# Altium schematic sheet Microcode.SchDoc
size B; Author: E. Sims; Organization: Let's Build Rockets Inc.; SheetNumber: 3; SheetTotal: 6; ENG_APP_DATE: --/--/--; DSN_APP_DATE: --/--/--; CHK_APP_DATE: --/--/--
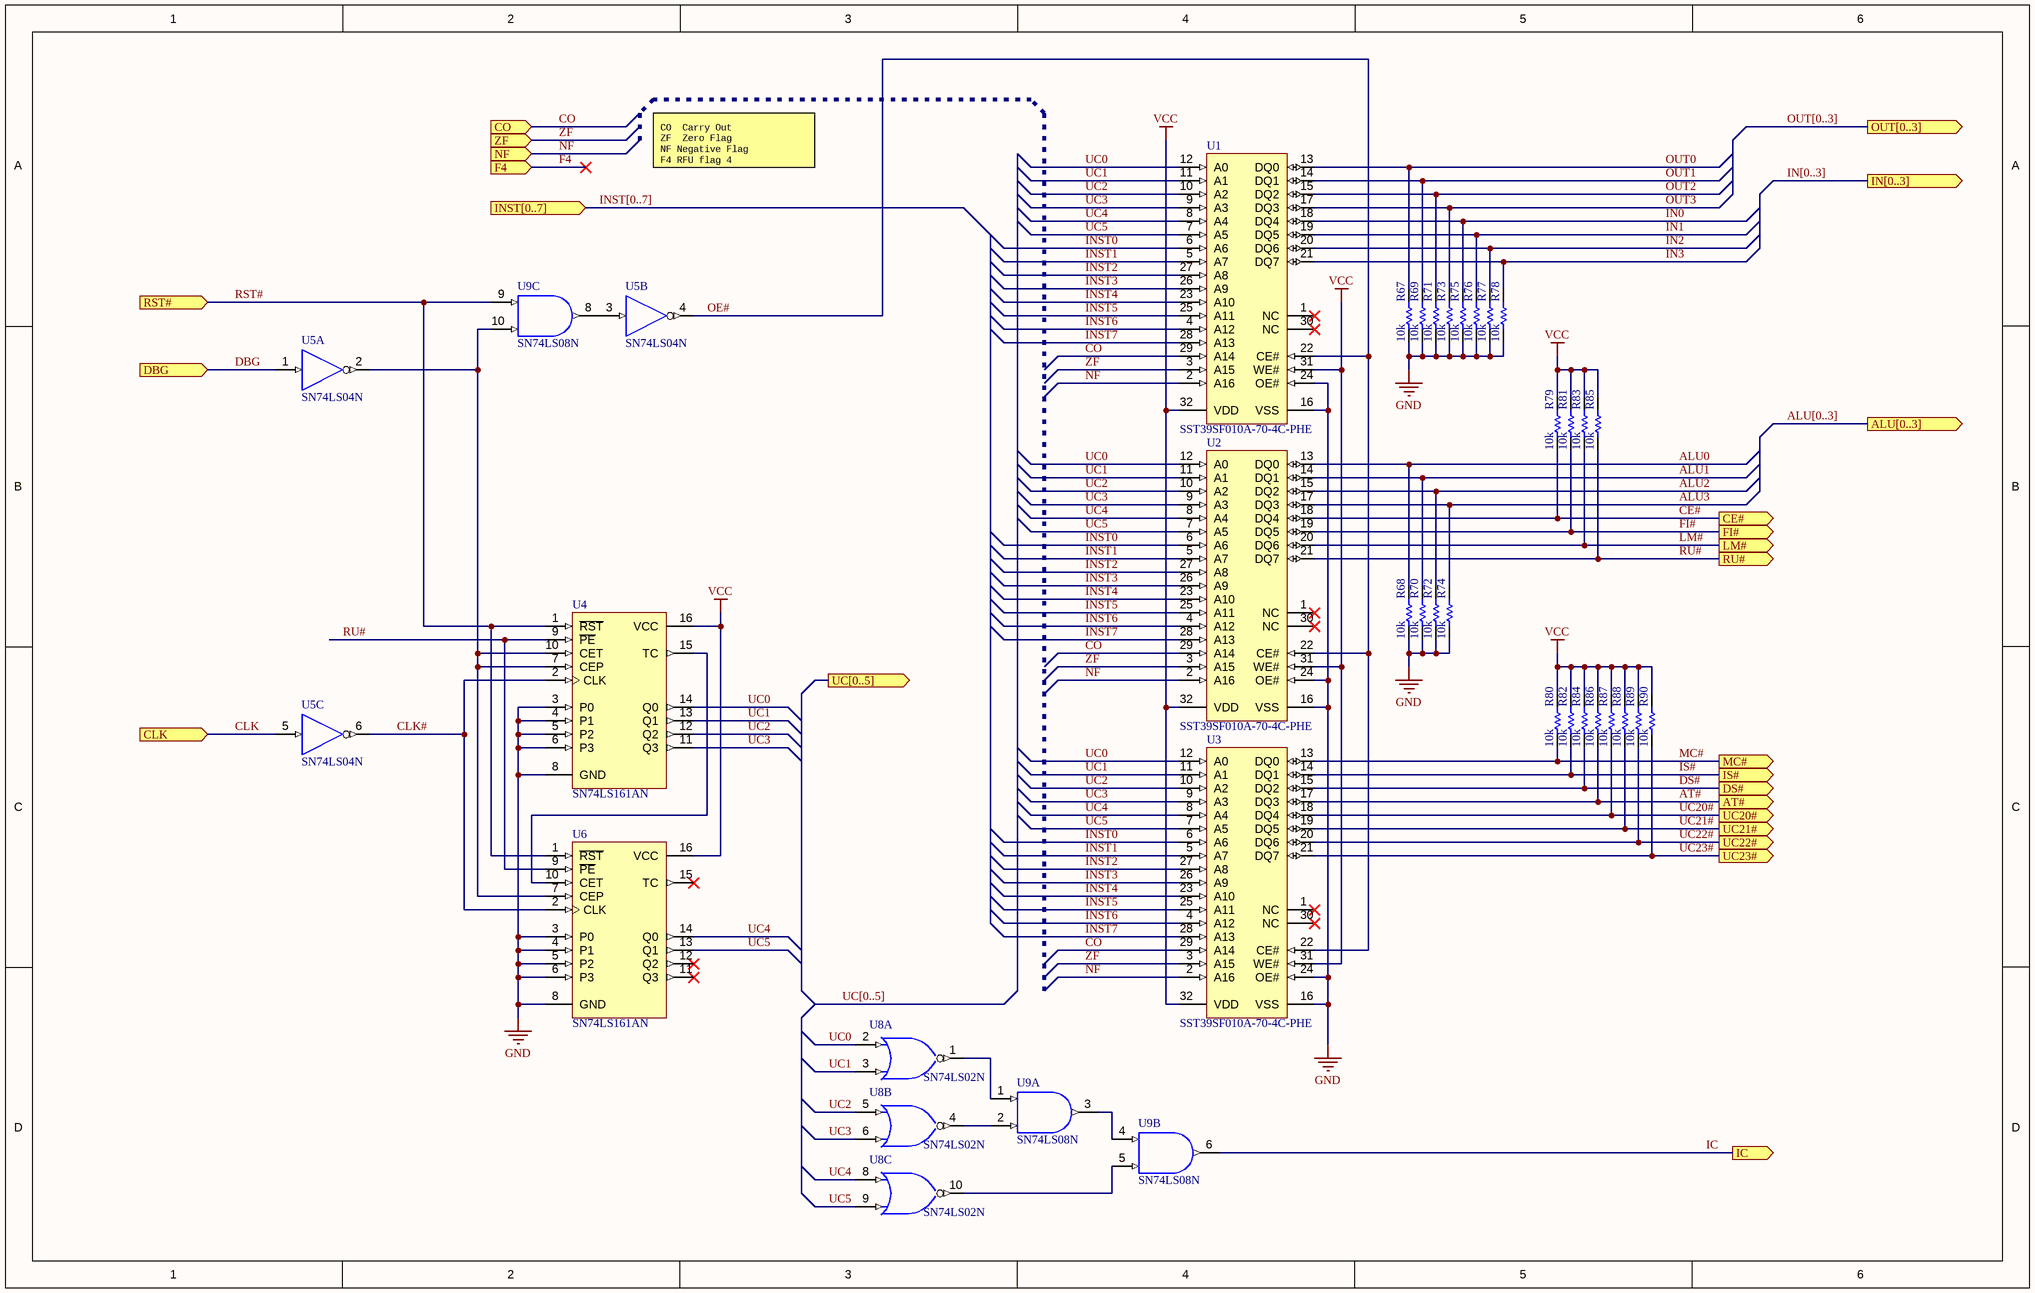
[diagram p0: Microcode.SchDoc]

## Parts
R67  value 10k  [AXIAL-0.3]  (hidden comment: Res1)
R68  value 10k  [AXIAL-0.3]  (hidden comment: Res1)
R69  value 10k  [AXIAL-0.3]  (hidden comment: Res1)
R70  value 10k  [AXIAL-0.3]  (hidden comment: Res1)
R71  value 10k  [AXIAL-0.3]  (hidden comment: Res1)
R72  value 10k  [AXIAL-0.3]  (hidden comment: Res1)
R73  value 10k  [AXIAL-0.3]  (hidden comment: Res1)
R74  value 10k  [AXIAL-0.3]  (hidden comment: Res1)
R75  value 10k  [AXIAL-0.3]  (hidden comment: Res1)
R76  value 10k  [AXIAL-0.3]  (hidden comment: Res1)
R77  value 10k  [AXIAL-0.3]  (hidden comment: Res1)
R78  value 10k  [AXIAL-0.3]  (hidden comment: Res1)
R79  value 10k  [AXIAL-0.3]  (hidden comment: Res1)
R80  value 10k  [AXIAL-0.3]  (hidden comment: Res1)
R81  value 10k  [AXIAL-0.3]  (hidden comment: Res1)
R82  value 10k  [AXIAL-0.3]  (hidden comment: Res1)
R83  value 10k  [AXIAL-0.3]  (hidden comment: Res1)
R84  value 10k  [AXIAL-0.3]  (hidden comment: Res1)
R85  value 10k  [AXIAL-0.3]  (hidden comment: Res1)
R86  value 10k  [AXIAL-0.3]  (hidden comment: Res1)
R87  value 10k  [AXIAL-0.3]  (hidden comment: Res1)
R88  value 10k  [AXIAL-0.3]  (hidden comment: Res1)
R89  value 10k  [AXIAL-0.3]  (hidden comment: Res1)
R90  value 10k  [AXIAL-0.3]  (hidden comment: Res1)
U1  SST39SF010A-70-4C-PHE  [MCHP-PDIP-PH32]
U2  SST39SF010A-70-4C-PHE  [MCHP-PDIP-PH32]
U3  SST39SF010A-70-4C-PHE  [MCHP-PDIP-PH32]
U4  SN74LS161AN  [N016]
U5  SN74LS04N  [N014]  (parts A,B,C of 6)
U6  SN74LS161AN  [N016]
U8  SN74LS02N  [N014]  (parts A,B,C of 4)
U9  SN74LS08N  [N014]  (parts A,B,C of 4)

## Ports
ALU[0..3] (out), AT# (out), CE# (out), CLK (in), CO (in), DBG (in), DS# (out), F4 (in), FI# (out), IC (out), IN[0..3] (out), INST[0..7] (in), IS# (out), LM# (out), MC# (out), NF (in), OUT[0..3] (out), RST# (in), RU# (out), UC20# (out), UC21# (out), UC22# (out), UC23# (out), UC[0..5] (out), ZF (in)

## Nets
GND: R67.1 R68.1 R69.1 R70.1 R71.1 R72.1 R73.1 R74.1 R75.1 R76.1 R77.1 R78.1 U1.16(VSS) U1.24(OE#) U2.16(VSS) U2.24(OE#) U3.16(VSS) U3.24(OE#) U4.3(P0) U4.4(P1) U4.5(P2) U4.6(P3) U4.8(GND) U5.7(GND) U6.3(P0) U6.4(P1) U6.5(P2) U6.6(P3) U6.8(GND) U8.7(GND) U9.7(GND)
VCC: R79.2 R80.2 R81.2 R82.2 R83.2 R84.2 R85.2 R86.2 R87.2 R88.2 R89.2 R90.2 U1.31(WE#) U1.32(VDD) U2.31(WE#) U2.32(VDD) U3.31(WE#) U3.32(VDD) U4.16(VCC) U5.14(VCC) U6.16(VCC) U8.14(VCC) U9.14(VCC)
ALU0: R68.2 U2.13(DQ0)
ALU1: R70.2 U2.14(DQ1)
ALU2: R72.2 U2.15(DQ2)
ALU3: R74.2 U2.17(DQ3)
AT#: R86.1 U3.17(DQ3) ; port AT#
CE#: R79.1 U2.18(DQ4) ; port CE#
CLK: U5.5(A) ; port CLK
CLK#: U4.2(CLK) U5.6(Y) U6.2(CLK)
CO: U1.29(A14) U2.29(A14) U3.29(A14) ; port CO
DBG: U5.1(A) ; port DBG
DS#: R84.1 U3.15(DQ2) ; port DS#
F4: port F4
FI#: R81.1 U2.19(DQ5) ; port FI#
IC: U9.6(Y) ; port IC
IN0: R75.2 U1.18(DQ4)
IN1: R76.2 U1.19(DQ5)
IN2: R77.2 U1.20(DQ6)
IN3: R78.2 U1.21(DQ7)
INST0: U1.6(A6) U2.6(A6) U3.6(A6)
INST1: U1.5(A7) U2.5(A7) U3.5(A7)
INST2: U1.27(A8) U2.27(A8) U3.27(A8)
INST3: U1.26(A9) U2.26(A9) U3.26(A9)
INST4: U1.23(A10) U2.23(A10) U3.23(A10)
INST5: U1.25(A11) U2.25(A11) U3.25(A11)
INST6: U1.4(A12) U2.4(A12) U3.4(A12)
INST7: U1.28(A13) U2.28(A13) U3.28(A13)
IS#: R82.1 U3.14(DQ1) ; port IS#
LM#: R83.1 U2.20(DQ6) ; port LM#
MC#: R80.1 U3.13(DQ0) ; port MC#
NF: U1.2(A16) U2.2(A16) U3.2(A16) ; port NF
OE#: U1.22(CE#) U2.22(CE#) U3.22(CE#) U5.4(Y)
OUT0: R67.2 U1.13(DQ0)
OUT1: R69.2 U1.14(DQ1)
OUT2: R71.2 U1.15(DQ2)
OUT3: R73.2 U1.17(DQ3)
RST#: U4.1(~{RST}) U6.1(~{RST}) U9.9(A) ; port RST#
RU#: R85.1 U2.21(DQ7) U4.9(~{PE}) U6.9(~{PE}) ; port RU#
UC0: U1.12(A0) U2.12(A0) U3.12(A0) U4.14(Q0) U8.2(A)
UC1: U1.11(A1) U2.11(A1) U3.11(A1) U4.13(Q1) U8.3(B)
UC2: U1.10(A2) U2.10(A2) U3.10(A2) U4.12(Q2) U8.5(A)
UC3: U1.9(A3) U2.9(A3) U3.9(A3) U4.11(Q3) U8.6(B)
UC4: U1.8(A4) U2.8(A4) U3.8(A4) U6.14(Q0) U8.8(A)
UC5: U1.7(A5) U2.7(A5) U3.7(A5) U6.13(Q1) U8.9(B)
UC20#: R87.1 U3.18(DQ4) ; port UC20#
UC21#: R88.1 U3.19(DQ5) ; port UC21#
UC22#: R89.1 U3.20(DQ6) ; port UC22#
UC23#: R90.1 U3.21(DQ7) ; port UC23#
ZF: U1.3(A15) U2.3(A15) U3.3(A15) ; port ZF
NetU4_7: U4.7(CEP) U4.10(CET) U5.2(Y) U6.7(CEP) U9.10(B)
NetU4_15: U4.15(TC) U6.10(CET)
NetU5_3: U5.3(A) U9.8(Y)
NetU8_1: U8.1(Y) U9.1(A)
NetU8_4: U8.4(Y) U9.2(B)
NetU8_10: U8.10(Y) U9.5(B)
NetU9_3: U9.3(Y) U9.4(A)

Not connected (* = marked no-connect by the designer): U1 1(NC)* 30(NC)*; U2 1(NC)* 30(NC)*; U3 1(NC)* 30(NC)*; U6 11(Q3)* 12(Q2)* 15(TC)*

## Buses and harness runs
bus ALU[0..3] = port ALU[0..3]
bus IN[0..3] = port IN[0..3]
bus INST[0..7] = port INST[0..7]
bus OUT[0..3] = port OUT[0..3]
bus UC[0..5] = port UC[0..5]

## Notes on the sheet
- CO  Carry Out
  ZF  Zero Flag
  NF Negative Flag
  F4 RFU flag 4
- DWG NO:
- REV:
- THIS DOCUMENT AND THE DATA DISCLOSED HEREIN OR
- HEREWITH IS THE PROPERTY OF ALTIUM LIMITED AND MAY
- BE FREELY DISTRIBUTED IN WHOLE. NO RIGHTS ARE
- RESERVED OR EXPRESS OR IMPLIED WARANTEE GIVEN.
- REVISION
- DESCRIPTION
- DATE
- APPROVED
- ENG:
- APPROVALS
- PROJECT
- DSN:
- CHK:
- REFERENCE DOCUMENTS
- PROJECT REVISION:
- TITLE
- DOCUMENT REVISION:
- DESIGN ITEM:
- BOM:
- FAB DWG:
- PCB DWG:
- ASSY DWG:
- SCALE:
- A2
- SIZE
- CAGE CODE
- FILE NAME
- DWG NO.
- SHEET
- OF
- REV

## Library data of the parts
R67-R90 = Res1: Resistor; Published: 8-Jun-2000; LatestRevisionDate: 17-Jul-2002; LatestRevisionNote: Re-released for DXP Platform.; PackageReference: AXIAL-0.3; Publisher: Altium Limited; PackageDescription: Axial Device, Thru-Hole; 2 Leads; 0.3 in Pin Spacing
U1-U3 = CMP-0378-00001-1: 1 Mbit Multi-Purpose Flash, 4.5 to 5.5 V, 1 kHz, 0 to 70 degC, 32-pin PDIP (PH32), Tube; Manufacturer: Microchip; ComponentLink3Description: Package Specification; ComponentLink1URL: http://www.microchip.com; ComponentLink2Description: Datasheet; PackageReference: PDIP-PH32; ComponentLink2URL: http://ww1.microchip.com/downloads/en/DeviceDoc/25022A.pdf; DatasheetVersion: Rev. A; ComponentLink3URL: http://ww1.microchip.com/downloads/en/DeviceDoc/25022A.pdf; ComponentLink4Description: Product URL; ComponentLink1Description: Manufacturer URL; PartNumber: SST39SF010A-70-4C-PHE; ComponentLink4URL: http://www.microchip.com/SST39SF010A; PackageDescription: 32-Pin Plastic Dual In-line Pins, Row Spacing 15.24 mm, 41.91 x 13.72 mm Body, 2.54 mm Pitch; Code_JEDEC: MO-015; Mounting Technology: Through Hole; PackageVersion: Rev. A
U4 U6 = SN74LS161AN: Synchronous 4-Bit Counter; Published: 8-Jun-2000; LatestRevisionDate: 04-Mar-2005; LatestRevisionNote: Stylized 3D Model Added.; DatasheetVersion: Mar-1988; PackageVersion: Oct-1995; PackageReference: N016; Publisher: Altium Limited; PackageDescription: DIP; 16 Leads; Row Spacing 7.62 mm; Pitch 2.54 mm; Code_JEDEC: MS-001-BB; ComponentLink1Description: Manufacturer Link; ComponentLink1URL: http://www.ti.com/; ComponentLink2Description: Datasheet; ComponentLink2URL: http://www-s.ti.com/sc/ds/sn74ls161a.pdf; ComponentLink3Description: URL Link1; ComponentLink3URL: http://focus.ti.com/docs/prod/folders/print/sn74ls161a.html
U5 = SN74LS04N: Hex Inverter; Published: 8-Jun-2000; LatestRevisionDate: 04-Mar-2005; LatestRevisionNote: Stylized 3D Model Added.; DatasheetVersion: Mar-1988; PackageVersion: Oct-1995; PackageReference: N014; Publisher: Altium Limited; PackageDescription: DIP; 14 Leads; Row Spacing 7.62 mm; Pitch 2.54 mm; ComponentLink1Description: Manufacturer Link; ComponentLink1URL: http://www.ti.com/; ComponentLink2Description: Datasheet; ComponentLink2URL: http://www-s.ti.com/sc/ds/sn74ls04.pdf
U8 = SN74LS02N: Quadruple 2-Input Positive-NOR Gate; Published: 8-Jun-2000; LatestRevisionDate: 04-Mar-2005; LatestRevisionNote: Stylized 3D Model Added.; DatasheetVersion: Mar-1988; PackageVersion: Oct-1995; PackageReference: N014; Publisher: Altium Limited; PackageDescription: DIP; 14 Leads; Row Spacing 7.62 mm; Pitch 2.54 mm; ComponentLink1Description: Manufacturer Link; ComponentLink1URL: http://www.ti.com/; ComponentLink2Description: Datasheet; ComponentLink2URL: http://www-s.ti.com/sc/ds/sn54s02.pdf
U9 = SN74LS08N: Quadruple 2-Input Positive-AND Gate; Published: 8-Jun-2000; LatestRevisionDate: 04-Mar-2005; LatestRevisionNote: Stylized 3D Model Added.; DatasheetVersion: Mar-1988; PackageVersion: Oct-1995; PackageReference: N014; Publisher: Altium Limited; PackageDescription: DIP; 14 Leads; Row Spacing 7.62 mm; Pitch 2.54 mm; ComponentLink1Description: Manufacturer Link; ComponentLink1URL: http://www.ti.com/; ComponentLink2Description: Datasheet; ComponentLink2URL: http://www-s.ti.com/sc/ds/SN74LS08.pdf